# EAGLE schematic KMO_IO_MV2_0 (EAGLE 9.4.0)

## Sheet 1 of 2
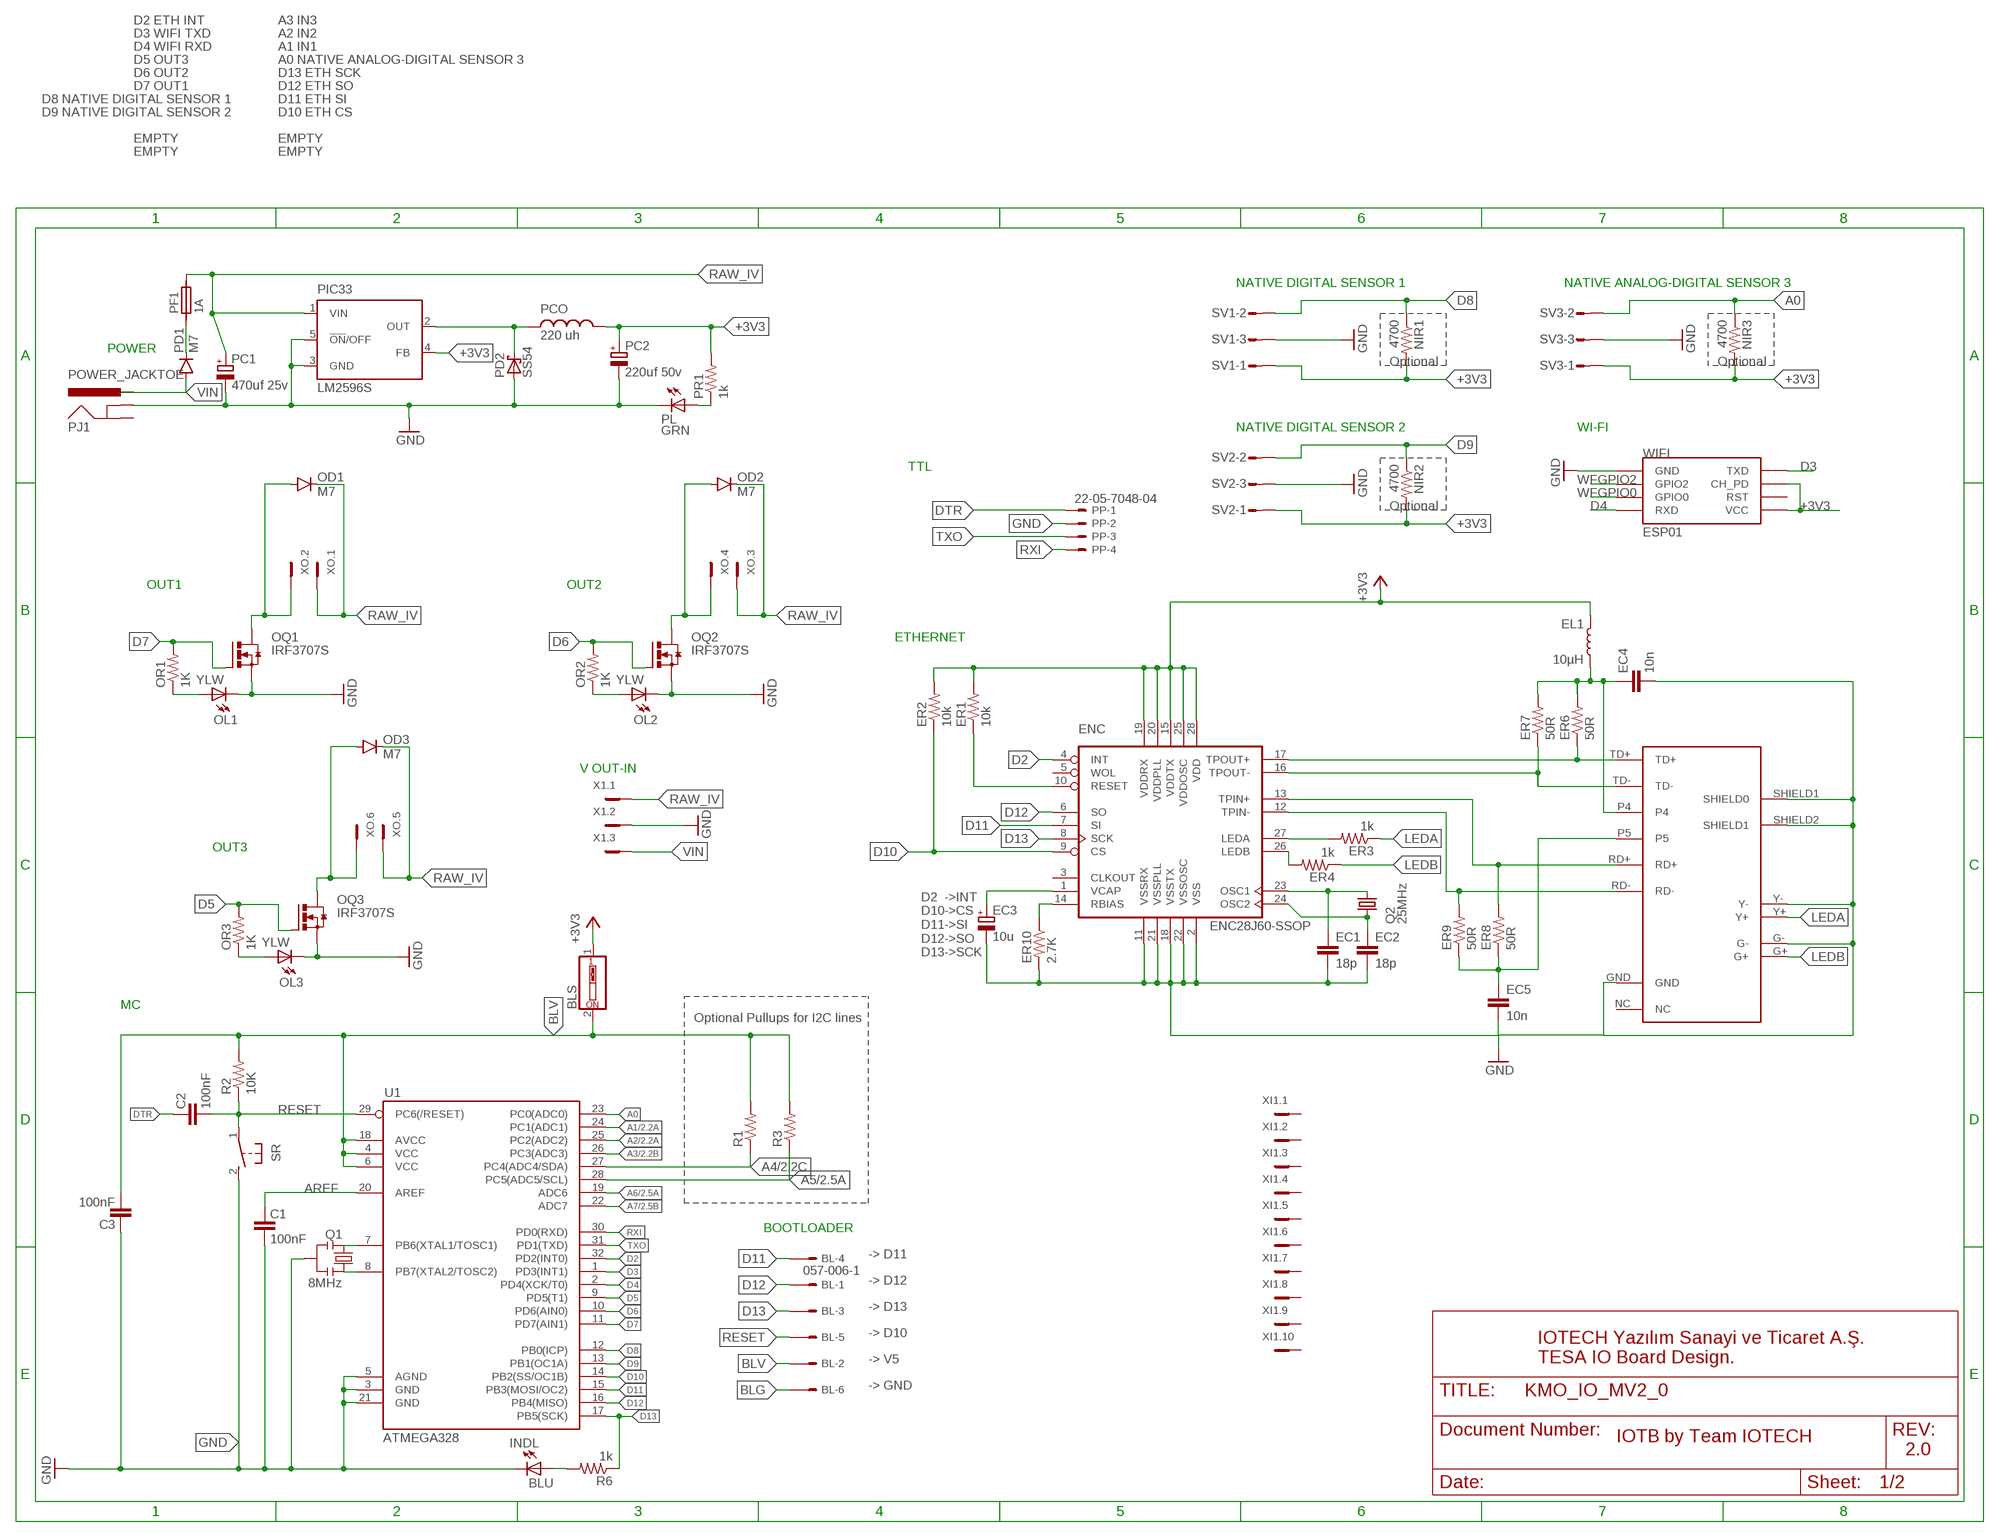
[diagram p0: schematic, sheet 1]

### Parts
BL  057-006-1  [057-006-1]
BLS  SW_DIP-1  [EDG-01]
C1  100nF  CAP0805  [0805]
C2  100nF  CAP0805  [0805]
C3  100nF  CAP0805  [0805]
EC1  18p  CAP0805  [0805]
EC2  18p  CAP0805  [0805]
EC3  10u  CPOL-EUCT3216  [CT3216]
EC4  10n  CAP0805  [0805]
EC5  10n  CAP0805  [0805]
EL1  10µH  INDUCTOR-0805-3.3UH  [0805]
ENC  ENC28J60-SSOP  [SSOP28]
ER1  10k  RESISTOR0805-RES  [0805]
ER2  10k  RESISTOR0805-RES  [0805]
ER3  1k  RESISTOR0805-RES  [0805]
ER4  1k  RESISTOR0805-RES  [0805]
ER6  50R  RESISTOR0805-RES  [0805]
ER7  50R  RESISTOR0805-RES  [0805]
ER8  50R  RESISTOR0805-RES  [0805]
ER9  50R  RESISTOR0805-RES  [0805]
ER10  2.7K  RESISTOR0805-RES  [0805]
INDL  BLU  LEDCHIP-LED0805  [CHIP-LED0805]
NIR1  4700  RESISTOR0805-RES  [0805]
NIR2  4700  RESISTOR0805-RES  [0805]
NIR3  4700  RESISTOR0805-RES  [0805]
OD1  M7  DIODESMA  [SMA-DIODE]
OD2  M7  DIODESMA  [SMA-DIODE]
OD3  M7  DIODESMA  [SMA-DIODE]
OL1  YLW  LEDCHIP-LED0805  [CHIP-LED0805]
OL2  YLW  LEDCHIP-LED0805  [CHIP-LED0805]
OL3  YLW  LEDCHIP-LED0805  [CHIP-LED0805]
OQ1  IRF3707S  IRF3704S  [D2PACK]
OQ2  IRF3707S  IRF3704S  [D2PACK]
OQ3  IRF3707S  IRF3704S  [D2PACK]
OR1  1K  RESISTOR0805-RES  [0805]
OR2  1K  RESISTOR0805-RES  [0805]
OR3  1K  RESISTOR0805-RES  [0805]
PC1  470uf 25v  CPOL-EU140CLH-1010  [140CLH-1010]
PC2  220uf 50v  CPOL-EU140CLH-1010  [140CLH-1010]
PCO  220 uh  MSS1260  [MSS1260]
PD1  M7  DIODESMA  [SMA-DIODE]
PD2  SS54  SCHOTTKY-DIODESMD  [SMB]
PF1  1A  SIBA194600  [1820]
PIC33  LM2596S  [TO263-5]
PJ1  POWER_JACKTOE  [POWER_JACK_SMD_OVERPASTE_TOE]
PL  GRN  LEDCHIP-LED0805  [CHIP-LED0805]
PP  22-05-7048-04  [7395-04]
PR1  1k  RESISTOR0805-RES  [0805]
Q1  8MHz  RESONATOR1:1  [RESONATOR-SMD-1:1]
Q2  25MHz  KX-9B  [5.0X3.2_2]
R1  RESISTOR0805-RES  [0805]
R2  10K  RESISTOR0805-RES  [0805]
R3  RESISTOR0805-RES  [0805]
R6  1k  RESISTOR0805-RES  [0805]
SR  31-XX  [B3F-31XX]
SV1  S03P  [S03P]
SV2  S03P  [S03P]
SV3  S03P  [S03P]
U1  ATMEGA328  ATMEGA168  [TQFP32-08]
U$2  HR911105A  [RJ45]
WIFI  ESP01  [ESP01]
X1  MC3  [MC3]
XI1  MC10  [MC10]
XO  MC6  [MC6]

### Nets
+3V3: BLS.1 EL1.1 ENC.15(VDDTX) ENC.19(VDDRX) ENC.20(VDDPLL) ENC.25(VDDOSC) ENC.28(VDD) ER1.2 ER2.2 NIR1.2 NIR2.2 NIR3.2 PC2.+ PCO.P$1 PIC33.4(FB) PR1.2 SV1.1 SV2.1 SV3.1 WIFI.CH_PD WIFI.VCC ; also sheet 2
A0: NIR3.1 SV3.2 U1.23(PC0(ADC0))
A1: U1.24(PC1(ADC1)) ; also sheet 2
A2: U1.25(PC2(ADC2)) ; also sheet 2
A3: U1.26(PC3(ADC3)) ; also sheet 2
A4: R1.1 U1.27(PC4(ADC4/SDA)) ; also sheet 2
A5: R3.1 U1.28(PC5(ADC5/SCL)) ; also sheet 2
A6: U1.19(ADC6) ; also sheet 2
A7: U1.22(ADC7) ; also sheet 2
AREF: C1.2 U1.20(AREF)
BLG: BL.6
BLV: BL.2 BLS.2 C3.1 R1.2 R2.2 R3.2 U1.4(VCC) U1.6(VCC) U1.18(AVCC)
D2: ENC.4(INT) U1.32(PD2(INT0))
D3: U1.1(PD3(INT1)) WIFI.TX(TXD)
D4: U1.2(PD4(XCK/T0)) WIFI.RX(RXD)
D5: OQ3.1(G) OR3.2 U1.9(PD5(T1))
D6: OQ2.1(G) OR2.2 U1.10(PD6(AIN0))
D7: OQ1.1(G) OR1.2 U1.11(PD7(AIN1))
D8: NIR1.1 SV1.2 U1.12(PB0(ICP))
D9: NIR2.1 SV2.2 U1.13(PB1(OC1A))
D10: ENC.9(CS) ER2.1 U1.14(PB2(SS/OC1B))
D11: BL.4 ENC.7(SI) U1.15(PB3(MOSI/OC2))
D12: BL.1 ENC.6(SO) U1.16(PB4(MISO))
D13: BL.3 ENC.8(SCK) R6.1 U1.17(PB5(SCK))
DTR: C2.2 PP.1
EP4: EC4.1 EL1.2 ER6.2 ER7.2 U$2.P4
EP5: EC5.1 ER8.1 ER9.1 U$2.P5
GND: C1.1 C3.2 EC1.2 EC2.2 EC3.- EC4.2 EC5.2 ENC.2(VSS) ENC.11(VSSRX) ENC.18(VSSTX) ENC.21(VSSPLL) ENC.22(VSSOSC) ER10.2 INDL.C OL1.C OL2.C OL3.C OQ1.3(S) OQ2.3(S) OQ3.3(S) PC1.- PC2.- PD2.A PIC33.3(GND) PIC33.5(!ON!/OFF) PJ1.GND(GNDBREAK) PL.C PP.2 Q1.2 SR.2(S) SV1.3 SV2.3 SV3.3 U1.3(GND) U1.5(AGND) U1.21(GND) U$2.G- U$2.GND U$2.SHIELD1(SHIELD0) U$2.SHIELD2(SHIELD1) U$2.Y- WIFI.GND X1.2 ; also sheet 2
LEDA: ER3.1 U$2.Y+
LEDB: ER4.1 U$2.G+
N$1: OD3.A OQ3.2(D) XO.6
N$2: PD1.C PF1.1
N$3: OD1.A OQ1.2(D) XO.2
N$4: OD2.A OQ2.2(D) XO.4
N$5: INDL.A R6.2
N$6: OL3.A OR3.1
N$7: OL2.A OR2.1
N$8: OL1.A OR1.1
N$9: ENC.27(LEDA) ER3.2
N$10: Q1.3 U1.8(PB7(XTAL2/TOSC2))
N$11: PL.A PR1.1
N$13: EC3.+ ENC.1(VCAP)
N$14: ENC.26(LEDB) ER4.2
N$15: Q1.1 U1.7(PB6(XTAL1/TOSC1))
N$16: PCO.P$2 PD2.C PIC33.2(OUT)
N$17: ENC.10(RESET) ER1.1
N$19: ENC.14(RBIAS) ER10.1
N$22: EC2.1 ENC.24(OSC2) Q2.1
N$24: EC1.1 ENC.23(OSC1) Q2.2
RAW_IV [vcc]: OD1.C OD2.C OD3.C PC1.+ PF1.2 PIC33.1(VIN) X1.1 XO.1 XO.3 XO.5
RD+: ENC.13(TPIN+) ER8.2 U$2.RD+
RD-: ENC.12(TPIN-) ER9.2 U$2.RD-
RESET: BL.5 C2.1 R2.1 SR.1(P) U1.29(PC6(/RESET))
RXI: PP.4 U1.30(PD0(RXD))
TD+: ENC.17(TPOUT+) ER6.1 U$2.TD+
TD-: ENC.16(TPOUT-) ER7.1 U$2.TD-
TXO: PP.3 U1.31(PD1(TXD))
VIN: PD1.A PJ1.VIN0(PWR) X1.3
WFGPIO0: WIFI.GPIO0 ; also sheet 2
WFGPIO2: WIFI.GPIO2
Unconnected: ENC.3(CLKOUT) ENC.5(WOL) PJ1.P$4(GND) U$2.NC WIFI.RST XI1.1 XI1.2 XI1.3 XI1.4 XI1.5 XI1.6 XI1.7 XI1.8 XI1.9 XI1.10

### Notes on the sheet
- D2 ETH INT | A3 IN3
- D3 WIFI TXD | A2 IN2
- D4 WIFI RXD | A1 IN1
- D5 OUT3 | A0 NATIVE ANALOG-DIGITAL SENSOR 3
- D6 OUT2 | D13 ETH SCK
- D7 OUT1 | D12 ETH SO
- D8 NATIVE DIGITAL SENSOR 1 | D11 ETH SI
- D9 NATIVE DIGITAL SENSOR 2 | D10 ETH CS
- EMPTY | EMPTY
- EMPTY | EMPTY
- NATIVE DIGITAL SENSOR 1 | NATIVE ANALOG-DIGITAL SENSOR 3
- POWER
- Optional | Optional
- NATIVE DIGITAL SENSOR 2 | WI-FI
- TTL
- Optional
- OUT1 | OUT2
- ETHERNET
- V OUT-IN
- OUT3
- D2  ->INT
  D10->CS
  D11->SI
  D12->SO
  D13->SCK
- MC
- Optional Pullups for I2C lines
- BOOTLOADER
- -> D11
- -> D12
- -> D13
- -> D10
- -> V5
- IOTECH Yazılım Sanayi ve Ticaret A.Ş.
  TESA IO Board Design.
- -> GND
- IOTB by Team IOTECH
- 2.0

## Sheet 2 of 2
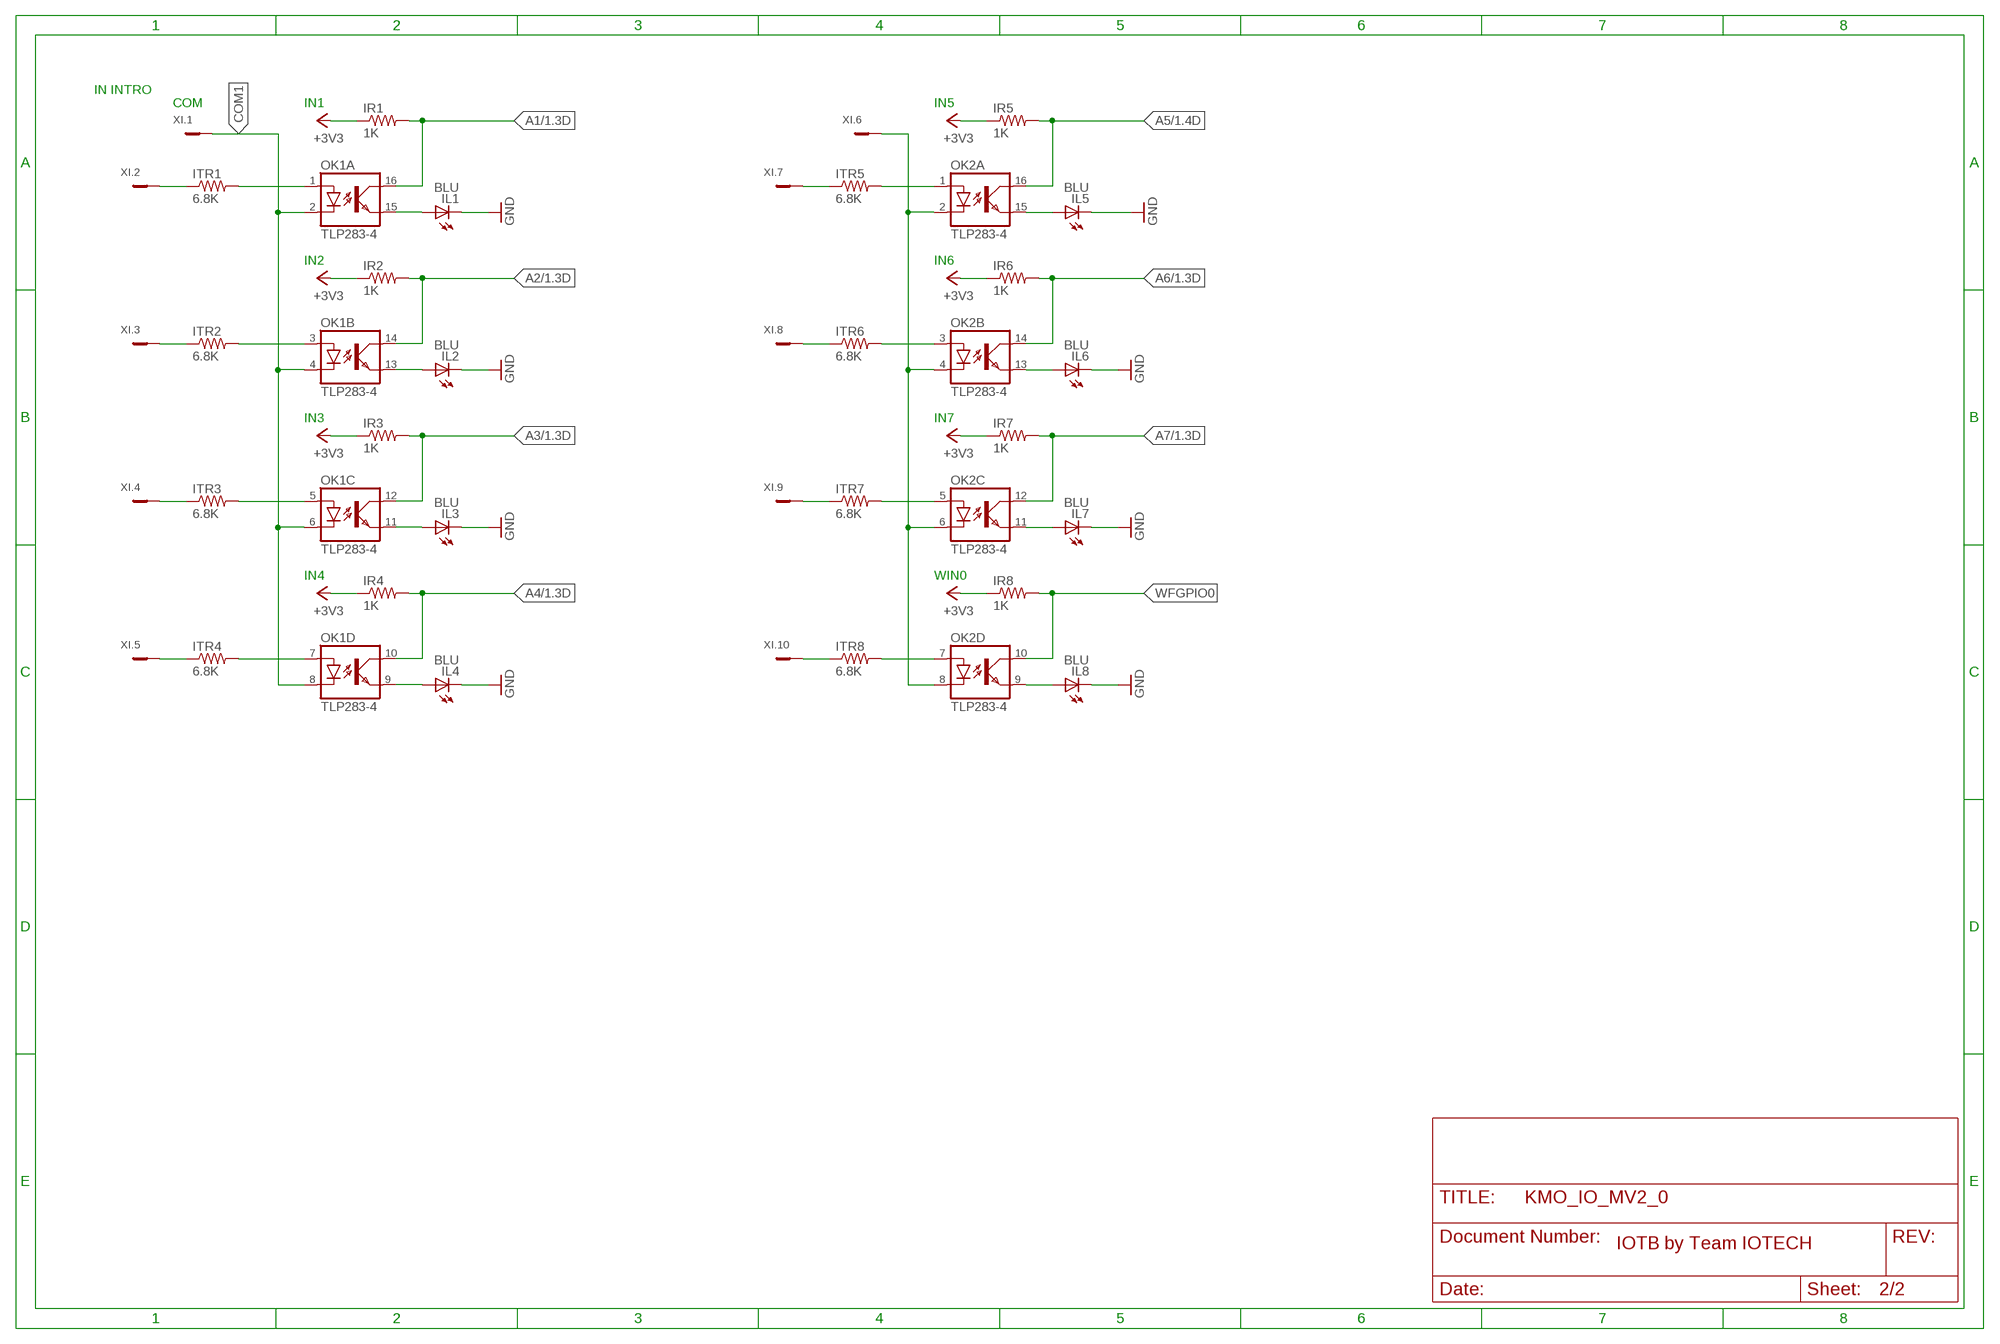
[diagram p1: schematic, sheet 2]

### Parts
IL1  BLU  LEDCHIP-LED0805  [CHIP-LED0805]
IL2  BLU  LEDCHIP-LED0805  [CHIP-LED0805]
IL3  BLU  LEDCHIP-LED0805  [CHIP-LED0805]
IL4  BLU  LEDCHIP-LED0805  [CHIP-LED0805]
IL5  BLU  LEDCHIP-LED0805  [CHIP-LED0805]
IL6  BLU  LEDCHIP-LED0805  [CHIP-LED0805]
IL7  BLU  LEDCHIP-LED0805  [CHIP-LED0805]
IL8  BLU  LEDCHIP-LED0805  [CHIP-LED0805]
IR1  1K  RESISTOR0805-RES  [0805]
IR2  1K  RESISTOR0805-RES  [0805]
IR3  1K  RESISTOR0805-RES  [0805]
IR4  1K  RESISTOR0805-RES  [0805]
IR5  1K  RESISTOR0805-RES  [0805]
IR6  1K  RESISTOR0805-RES  [0805]
IR7  1K  RESISTOR0805-RES  [0805]
IR8  1K  RESISTOR0805-RES  [0805]
ITR1  6.8K  RESISTOR0805-RES  [0805]
ITR2  6.8K  RESISTOR0805-RES  [0805]
ITR3  6.8K  RESISTOR0805-RES  [0805]
ITR4  6.8K  RESISTOR0805-RES  [0805]
ITR5  6.8K  RESISTOR0805-RES  [0805]
ITR6  6.8K  RESISTOR0805-RES  [0805]
ITR7  6.8K  RESISTOR0805-RES  [0805]
ITR8  6.8K  RESISTOR0805-RES  [0805]
OK1  TLP283-4  [MINI-FLAT-16]
OK2  TLP283-4  [MINI-FLAT-16]
XI  MC10  [MC10]

### Nets
+3V3: IR1.1 IR2.1 IR3.1 IR4.1 IR5.1 IR6.1 IR7.1 IR8.1 ; also sheet 1
A1: IR1.2 OK1.16(A:COL) ; also sheet 1
A2: IR2.2 OK1.14(B:COL) ; also sheet 1
A3: IR3.2 OK1.12(C:COL) ; also sheet 1
A4: IR4.2 OK1.10(D:COL) ; also sheet 1
A5: IR5.2 OK2.16(A:COL) ; also sheet 1
A6: IR6.2 OK2.14(B:COL) ; also sheet 1
A7: IR7.2 OK2.12(C:COL) ; also sheet 1
COM1: OK1.2(A:C) OK1.4(B:C) OK1.6(C:C) OK1.8(D:C) XI.1
GND: IL1.C IL2.C IL3.C IL4.C IL5.C IL6.C IL7.C IL8.C ; also sheet 1
N$12: IL1.A OK1.15(A:EMIT)
N$18: ITR1.1 XI.2
N$20: IL2.A OK1.13(B:EMIT)
N$21: IL3.A OK1.11(C:EMIT)
N$23: IL4.A OK1.9(D:EMIT)
N$25: IL5.A OK2.15(A:EMIT)
N$26: IL6.A OK2.13(B:EMIT)
N$27: IL7.A OK2.11(C:EMIT)
N$28: ITR2.1 XI.3
N$29: ITR1.2 OK1.1(A:A)
N$30: ITR2.2 OK1.3(B:A)
N$31: ITR3.2 OK1.5(C:A)
N$32: ITR4.2 OK1.7(D:A)
N$33: ITR3.1 XI.4
N$34: ITR4.1 XI.5
N$35: OK2.2(A:C) OK2.4(B:C) OK2.6(C:C) OK2.8(D:C) XI.6
N$36: ITR5.1 XI.7
N$37: ITR5.2 OK2.1(A:A)
N$38: ITR6.1 XI.8
N$39: ITR6.2 OK2.3(B:A)
N$40: ITR7.1 XI.9
N$41: ITR7.2 OK2.5(C:A)
N$42: ITR8.1 XI.10
N$43: ITR8.2 OK2.7(D:A)
N$44: IL8.A OK2.9(D:EMIT)
WFGPIO0: IR8.2 OK2.10(D:COL) ; also sheet 1

### Notes on the sheet
- IN INTRO
- COM | IN1 | IN5
- IN2 | IN6
- IN3 | IN7
- IN4 | WIN0
- IOTB by Team IOTECH

## Library data of the parts
BL = con-panduit:057-006-: CONNECTOR 6-pin series 057 contact pc board low profile headers; OC_FARNELL: unknown; OC_NEWARK: unknown
BLS = special:SW_DIP-1: DIP SWITCH
C1-C3 EC1 EC2 EC4 EC5 = SparkFun-Passives:CAP: Capacitor Standard 0603 ceramic capacitor, and 0.1" leaded capacitor.
EC3 PC1 PC2 = rcl:CPOL-EU: POLARIZED CAPACITOR, European symbol; SPICEPREFIX: C
EL1 = SparkFun-Coils:INDUCTOR: Inductors Resist changes in electrical current. Basically a coil of wire. SparkFun Products: SparkFun Load Cell Amplifier - HX711 <https://www.sparkfun.com/products/13879> IOIO-OTG - V2.2 <https://www.sparkfun.com/products/13613>; PROD_ID: NDUC-13076; VALUE: 3.3µH/±20%/450mA
ENC = microchip-enc28j60:ENC28J60-*: Microchip 10Mbit Eth. contoller with SPI interface
ER1-ER4 ER6-ER10 IR1-IR8 ITR1-ITR8 NIR1-NIR3 OR1-OR3 PR1 R1-R3 R6 = SparkFun-Passives:RESISTOR: Resistor Basic schematic elements and footprints for 0603, 1206, and PTH resistors.
IL1-IL8 INDL OL1-OL3 PL = led:LED: LED OSRAM: - CHIPLED LG R971, LG N971, LY N971, LG Q971, LY Q971, LO R971, LY R971 LH N974, LH R974 LS Q976, LO Q976, LY Q976 LO Q996 - Hyper CHIPLED LW Q18S LB Q993, LB Q99A, LB R99A - SideLED LS A670, LO A670, LY A670, LG A670, LP A670 LB A673, LV A673, LT A673, LW A673 LH A674 LY A675 LS A676, LA A676, LO A676, LY A676, LW A676 LS A679, LY A679, LG A679 - Hyper Micro SIDELED® LS Y876, LA Y876, LO Y876, LY Y876 LT Y87S - SmartLED LW L88C, LW L88S LB L89C, LB L89S, LG L890 LS L89K, LO L89K, LY L89K LS L896, LA L896, LO L896, LY L896 - TOPLED LS T670, LO T670, LY T670, LG T670, LP T670 LSG T670, LSP T670, LSY T670, LOP T670, LYG T670 LG T671, LOG T671, LSG T671 LB T673, LV T673, LT T673, LW T673 LH T674 LS T676, LA T676, LO T676, LY T676, LB T676, LH T676, LSB T676, LW T676 LB T67C, LV T67C, LT T67C, LS T67K, LO T67K, LY T67K, LW E67C LS E67B, LA E67B, LO E67B, LY E67B, LB E67C, LV E67C, LT E67C LW T67C LS T679, LY T679, LG T679 LS T770, LO T770, LY T770, LG T770, LP T770 LB T773, LV T773, LT T773, LW T773 LH T774 LS E675, LA E675, LY E675, LS T675 LS T776, LA T776, LO T776, LY T776, LB T776 LHGB T686 LT T68C, LB T68C - Hyper Mini TOPLED® LB M676 - Mini TOPLED Santana® LG M470 LS M47K, LO M47K, LY M47K Source: http://www.osram.convergy.de LUXEON: - LUMILED® LXK2-PW12-R00, LXK2-PW12-S00, LXK2-PW14-U00, LXK2-PW14-V00 LXK2-PM12-R00, LXK2-PM12-S00, LXK2-PM14-U00 LXK2-PE12-Q00, LXK2-PE12-R00, LXK2-PE12-S00, LXK2-PE14-T00, LXK2-PE14-U00 LXK2-PB12-K00, LXK2-PB12-L00, LXK2-PB12-M00, LXK2-PB14-N00, LXK2-PB14-P00, LXK2-PB14-Q00 LXK2-PR12-L00, LXK2-PR12-M00, LXK2-PR14-Q00, LXK2-PR14-R00 LXK2-PD12-Q00, LXK2-PD12-R00, LXK2-PD12-S00 LXK2-PH12-R00, LXK2-PH12-S00 LXK2-PL12-P00, LXK2-PL12-Q00, LXK2-PL12-R00 Source: www.luxeon.com KINGBRIGHT: KA-3528ASYC Source: www.kingbright.com
OD1-OD3 PD1 = SparkFun-DiscreteSemi:DIODE: Diode These are standard reverse protection diodes and small signal diodes. SMA package can handle up to about 1A. SOD-323 can handle about 200mA. What the SOD-323 package when ordering, there are some mfgs out there that are 5-pin packages.
OK1 OK2 = optocoupler:TLP283-4: TOSHIBA PHOTOCOUPLER GaAs IRED & PHOTO-TRANSISTOR Source: http://www.semicon.toshiba.co.jp/td/en/Opto/Photocoupler/en_20050928_TLP283_datasheet.pdf; OC_FARNELL: unknown; OC_NEWARK: unknown
OQ1-OQ3 = transistor-power:IRF3704: SMPS MOSFET HEXFET® Power MOSFET Source: http://www.irf.com/product-info/datasheets/data/irf3704.pdf
PCO = inductor-coilcraft:MSS1260: SMT Power Inductor
PD2 = diode:SCHOTTKY-DIODE: Schottky Diode
PF1 = _hhn_PtcFuses_Siba_r500_Ozan:SIBA194600*: SIBA PTC-Fuses, Series 194600, 1812 (4.5 3.2)mm Source: www.siba.de/ Package: SMD 1812 (4.5 x 3.2)mm Technologies: SIBA194600Axxx xxx: Trip-Current * 10 mA Author: Dipl.-Ing. FH Rainer Bayer
PIC33 = national-semiconductor:LM2596: SIMPLE SWITCHER® Power Converter 150 kHz 3A Step-Down Voltage Regulator Source: http://www.national.com/ds/LM/LM2596.pdf; MF: NATIONAL SEMICONDUCTOR; MPN: LM2596S-ADJ/NOPB; OC_FARNELL: 9494367; OC_NEWARK: 41K3842
PJ1 = SparkFun-Connectors:POWER_JACK: Power Jack Connector This is the standard 5.5mm barrel jack for power. The PTH is the most common, proven, reliable, footprint. The Slot footprint only works if the mill layer is transmitted to the PCB fab house so be warned. Here are the connectors we sell at SparkFun: DC Barrel Power Jack/Connector <https://www.sparkfun.com/products/119> (PRT-00119) DC Barrel Power Jack/Connector (SMD) <https://www.sparkfun.com/products/12748> (PRT-12748) DC Barrel Jack Adapter - Breadboard Compatible <https://www.sparkfun.com/products/10811> (PRT-10811) It is used on this SparkFun product (and many, many others): SparkFun RedBoard - Programmed with Arduino <https://www.sparkfun.com/products/12757> (DEV-12757) Also, if you need a mating power supply or connector, please check these out: Wall Adapter Power Supply - 9VDC 650mA <https://www.sparkfun.com/products/298> (TOL-00298) DC Barrel Jack Adapter - Male <https://www.sparkfun.com/products/10287> (PRT-10287); PROD_ID: CONN-08106; SF_ID: PRT-12748
PP = con-molex:22-?-04: CONNECTOR wire to board 2.54 mm (.1 inch) pitch header; MF: MOLEX; OC_FARNELL: unknown; OC_NEWARK: unknown
Q1 = Testing:RESONATOR: Resonator Small SMD resonator. This is the itty bitty 10/20MHz resonators with built in caps. CSTCE10M0G55 and CSTCE20M0V53. Footprint for SMD has been used in SFE production for years, and does work okay. 1:1 is an attempt to get larger fillets on the sides so it will be easier to inspect these solders in our AOI machine. The pads have been minimized to match the actual metal under the resonator. To see this relation, it includes an image import of the bottom side of the component. Imported to scale on layer 200.
Q2 = crystal-geyer_V1_0:KX: Quartz Crystals (MHz) SMD: KX - Serie Model Size l/w/h [mm] Frequency Range Frequency Stability Temp. Range [°C] Load Capacitance AECQ 200 availabel Datasheet KX-4 KX-5 KX-6 KX-7 KX-9A KX-9B KX-12A KX-12B KX-13 KX-20 KX-K KX-KS 1.6/1.2/0.3 2.0/1.6/0.45 2.5/2.0/0.55 3.2/2.5/0.8 5.0/3.2/1.0 5.0/3.2/1.1 6.0/3.5/1.1 6.0/3.5/1.0 7.0/5.0 /1.3 11.6/5.5/1.6 12.3/4.5/4.2 12.3/4.5/3.2 24.0 ~ 80.0 MHz 16.0 ~ 80.0 MHz 12.0 ~ 80.0 MHz 8.0 ~ 60.0 MHz 7,68 ~ 300,0 MHz 8,0 ~ 50,0 MHz 8,0 ~ 150,0 MHz 8,0 ~ 50,0 MHz 6,0 ~ 160,0 MHz 3,579 ~ 25,0 MHz 3,579 ~ 70,0 MHz 3,579 ~ 70,0 MHz ±10 … ±50ppm ±10 … ±50ppm ±10 … ±50ppm ±10 … ±50ppm ±10 … ±50ppm ±10 … ±50ppm ±10 … ±50ppm ±10 … ±50ppm ±10 … ±50ppm ±50ppm ±10 … ±50ppm ±10 … ±50ppm (*) -40°C …+85°C (*) -40°C …+125°C (*) -40°C …+125°C (*) -40°C …+125°C (*) -40°C …+105°C (*) -40°C …+105°C (*) -40°C …+125°C (*) -40°C …+105°C (*) -40°C …+105°C (*) -40°C …+105°C (*) -40°C …+85°C (*) -40°C …+85°C 8, 8…16 8, 8…16 10, 8…16 12, 7…20 16, 10…20 16, 10…20 16, 10…20 16, 12…20 16, 12…20 16, 12…20 16, 12…30 16, 12…30 - yes yes yes - - - - - - - - KX-4.pdf <http://www.geyer-electronic.de/uploads/tx_userartikelfrequenz/GEYER-KX-4.pdf> KX-5.pdf <http://www.geyer-electronic.de/uploads/tx_userartikelfrequenz/GEYER-KX-5.pdf> KX-6.pdf <http://www.geyer-electronic.de/uploads/tx_userartikelfrequenz/GEYER-KX-6.pdf> KX-7.pdf <http://www.geyer-electronic.de/uploads/tx_userartikelfrequenz/GEYER-KX-7.pdf> KX-9A.pdf <http://www.geyer-electronic.de/uploads/tx_userartikelfrequenz/GEYER-KX-9A.pdf> KX-9B.pdf <http://www.geyer-electronic.de/uploads/tx_userartikelfrequenz/GEYER-KX-9B.pdf> KX-12A.pdf <http://www.geyer-electronic.de/uploads/tx_userartikelfrequenz/GEYER-KX-12A.pdf> KX-12B.pdf <http://www.geyer-electronic.de/uploads/tx_userartikelfrequenz/GEYER-KX-12B.pdf> KX-13.pdf <http://www.geyer-electronic.de/uploads/tx_userartikelfrequenz/GEYER-KX-13.pdf> KX-20.pdf <http://www.geyer-electronic.de/uploads/tx_userartikelfrequenz/GEYER-KX-20.pdf> KX-K.pdf <http://www.geyer-electronic.de/uploads/tx_userartikelfrequenz/GEYER-KX-K.pdf> KX-KS.pdf <http://www.geyer-electronic.de/uploads/tx_userartikelfrequenz/GEYER-KX-KS.pdf> <http://www.geyer-electronic.de/fileadmin/template/img/logo-geyer-electronic.png> Details see: http://www.geyer-electronic.de/Frequenz-Produkte.9.0.html Created 2016-06-07, Hans Locher 2016 (C) Geyer Quartz Technology KX4,KX5,KX6,KX7,KX9A,KX9B,KX12A,KX12B,KX13,KX20,KXK,KXKS;1612;2016;2520;3225;5032;6035;7050;11655;12345;1,6x1,2;2,0x1,6;2,5x2,0;3,2x2,5;5,0x3,2;6,0x3,5;7,0x5,0;11,6x5,5;12,3x4,5;12,3x4,5;1.6x1.2;2.0x1.6;2.5x2.0;3.2x2.5;5.0x3.2;6.0x3.5;7.0x5.0;11.6x5.5;12.3x4.5;12.3x4.5;
SR = switch-omron:31-XX: OMRON SWITCH; MPN: B3F-3100; OC_FARNELL: 959704; OC_NEWARK: 36M3582
SV1-SV3 = con_io_sxp:S03P: AMP MT CONNECTOR
U1 = SparkFun:ATMEGA168
U$2 = HR911105A:HR911105A
WIFI = esp8266modules:ESP01: ESP8266 Wifi module 01
X1 = con-phoenix-381_l:MC3: Mini-Combicon 3.81mm horizontal 3-polig (ohne Gegenstecker)
XI XI1 = con-phoenix-381_l:MC10: Mini-Combicon 3.81mm horizontal 10-polig (ohne Gegenstecker)
XO = con-phoenix-381_l:MC6: Mini-Combicon 3.81mm horizontal 6-polig (ohne Gegenstecker)

## Net classes
0 default: width 0.203 mm, drill 0.3 mm, clearance 0.16 mm
1 vcc: width 0.254 mm, drill 0.3 mm, clearance 0.16 mm